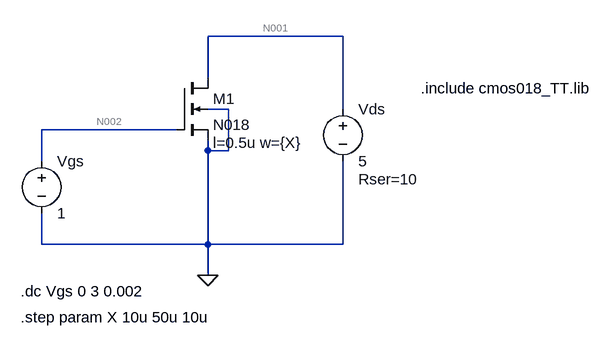
[diagram p0: schematic N018_Char.asc]
N018_Char.asc, the LTspice schematic file:
Version 4
SHEET 1 880 680
WIRE 416 96 208 96
WIRE 208 160 208 96
WIRE 240 208 208 208
WIRE 416 208 416 96
WIRE 160 240 -48 240
WIRE 208 272 208 256
WIRE 240 272 240 208
WIRE 240 272 208 272
WIRE -48 288 -48 240
WIRE -48 416 -48 368
WIRE 208 416 208 272
WIRE 208 416 -48 416
WIRE 416 416 416 288
WIRE 416 416 208 416
WIRE 208 464 208 416
FLAG 208 464 0
SYMBOL voltage -48 272 R0
WINDOW 123 0 0 Left 0
WINDOW 39 0 0 Left 0
SYMATTR InstName Vgs
SYMATTR Value 1
SYMBOL voltage 416 192 R0
WINDOW 123 0 0 Left 0
WINDOW 39 24 124 Left 2
SYMATTR SpiceLine Rser=10
SYMATTR InstName Vds
SYMATTR Value 5
SYMBOL nmos4 160 160 R0
WINDOW 123 56 100 Left 2
SYMATTR InstName M1
SYMATTR Value N018
SYMATTR Value2 l=0.5u w={X}
TEXT 536 176 Left 2 !.include cmos018_TT.lib
TEXT -80 488 Left 2 !.dc Vgs 0 3 0.002
TEXT -80 528 Left 2 !.step param X 10u 50u 10u

The netlist it stands for:
* N018_Char.asc
Vgs N002 0 1
Vds N001 0 5 Rser=10
M1 N001 N002 0 0 N018 l=0.5u w={X}
.model NMOS NMOS
.model PMOS PMOS
.lib standard.mos
.include cmos018_TT.lib
.dc Vgs 0 3 0.002
.step param X 10u 50u 10u
.backanno
.end

* Results of the author's LTspice run, read from the files saved beside the schematic
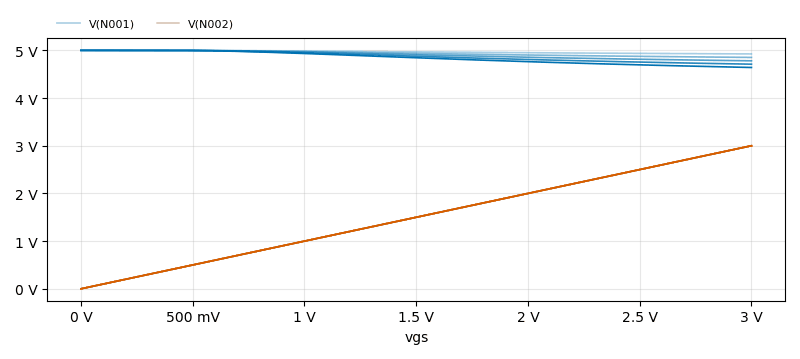
[diagram p1: DC transfer characteristic of N018_Char.asc, plotted from the saved traces]
* DC transfer characteristic, 5 runs:
*   V(N001) [x=1e-005]: 5 V at vgs=0 V, 4.925 V at vgs=3 V, min 4.925 V, max 5 V
*   V(N001) [x=2e-005]: 5 V at vgs=0 V, 4.852 V at vgs=3 V, min 4.852 V, max 5 V
*   V(N001) [x=3e-005]: 5 V at vgs=0 V, 4.781 V at vgs=3 V, min 4.781 V, max 5 V
*   V(N001) [x=4e-005]: 5 V at vgs=0 V, 4.71 V at vgs=3 V, min 4.71 V, max 5 V
*   V(N001) [x=5e-005]: 5 V at vgs=0 V, 4.641 V at vgs=3 V, min 4.641 V, max 5 V
*   V(N002) [x=1e-005]: 0 V at vgs=0 V, 3 V at vgs=3 V, min 0 V, max 3 V
*   V(N002) [x=2e-005]: 0 V at vgs=0 V, 3 V at vgs=3 V, min 0 V, max 3 V
*   V(N002) [x=3e-005]: 0 V at vgs=0 V, 3 V at vgs=3 V, min 0 V, max 3 V
*   V(N002) [x=4e-005]: 0 V at vgs=0 V, 3 V at vgs=3 V, min 0 V, max 3 V
*   V(N002) [x=5e-005]: 0 V at vgs=0 V, 3 V at vgs=3 V, min 0 V, max 3 V